# Altium schematic sheet LowKey.SchDoc
size A4
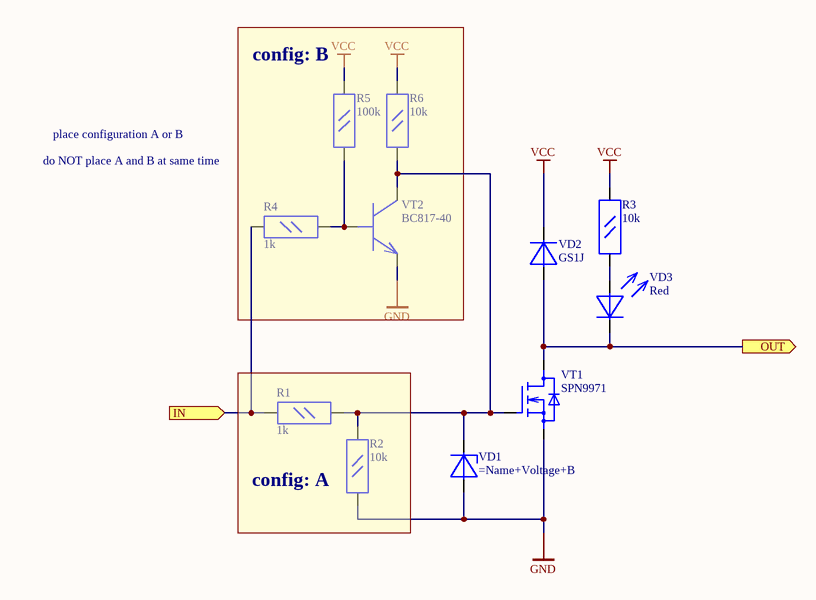
[diagram p0: LowKey.SchDoc]

## Parts
R1  Resistance (Ohms): 1k  [RES0805]  (hidden comment: R0805)
R2  Resistance (Ohms): 10k  [RES0805]  (hidden comment: R0805)
R3  Resistance (Ohms): 10k  [RES0805]  (hidden comment: R0805)
R4  Resistance (Ohms): 1k  [RES0805]  (hidden comment: R0805)
R5  Resistance (Ohms): 100k  [RES0805]  (hidden comment: R0805)
R6  Resistance (Ohms): 10k  [RES0805]  (hidden comment: R0805)
VD1  (no value)  [SOD323]
VD2  GS1J  [DO-214AC(SMA)]
VD3  Color: Red  [3mm led red]  (hidden comment: Led Red 3mm)
VT1  SPN9971  [DPAK]
VT2  BC817-40  [SOT95P230X110-3N]

## Blocks framed on the sheet
config: B: R4-R6 VT2
config: A: R1 R2

## Ports
IN (in), OUT (out)

## Nets
GND: R2.1 VD1.2(A) VT1.3(S) VT2.2(E)
VCC: R3.2 R5.2 R6.2 VD2.1(C)
IN: R1.1 R4.1 ; port IN
OUT: VD2.2(A) VD3.1(C) VT1.2(D) ; port OUT
NetR1_2: R1.2 R2.2 R6.1 VD1.1(C) VT1.1(G) VT2.3(C)
NetR3_1: R3.1 VD3.2(A)
NetR4_2: R4.2 R5.1 VT2.1(B)

## Notes on the sheet
- place configuration A or B
- do NOT place A and B at same time

## Library data of the parts
R1-R6 = R0805: Resistor; Power (Watts): 1/8W; Package: 0805; Category: Resistors
VD1 = PDZ-B: Diode; Name: PDZ; Voltage: 12; Package: SOD323
VD2 = GS1J: 1.0A Surface Mount Standard Diode; Manufacturer: WTE; Voltage: 600V; Name: GS1J; Package: SMA(DO-214AC)
VD3 = Led Red 3mm: 3mm Red Led 2.54pitch
VT1 = SPN9971: N-channel MOSFET transistor; Package: DPAK; Name: SPN9971
VT2 = BC817-40: NPN bipolar transistor; Package: SOT23; Name: BC817-40